# Altium schematic sheet carrier_card_s2.SchDoc: Power / Power-On/Off Sequencing
size A4; DrawnBy: Thomas Christensen; Revision: 2; SheetNumber: 2; SheetTotal: 3
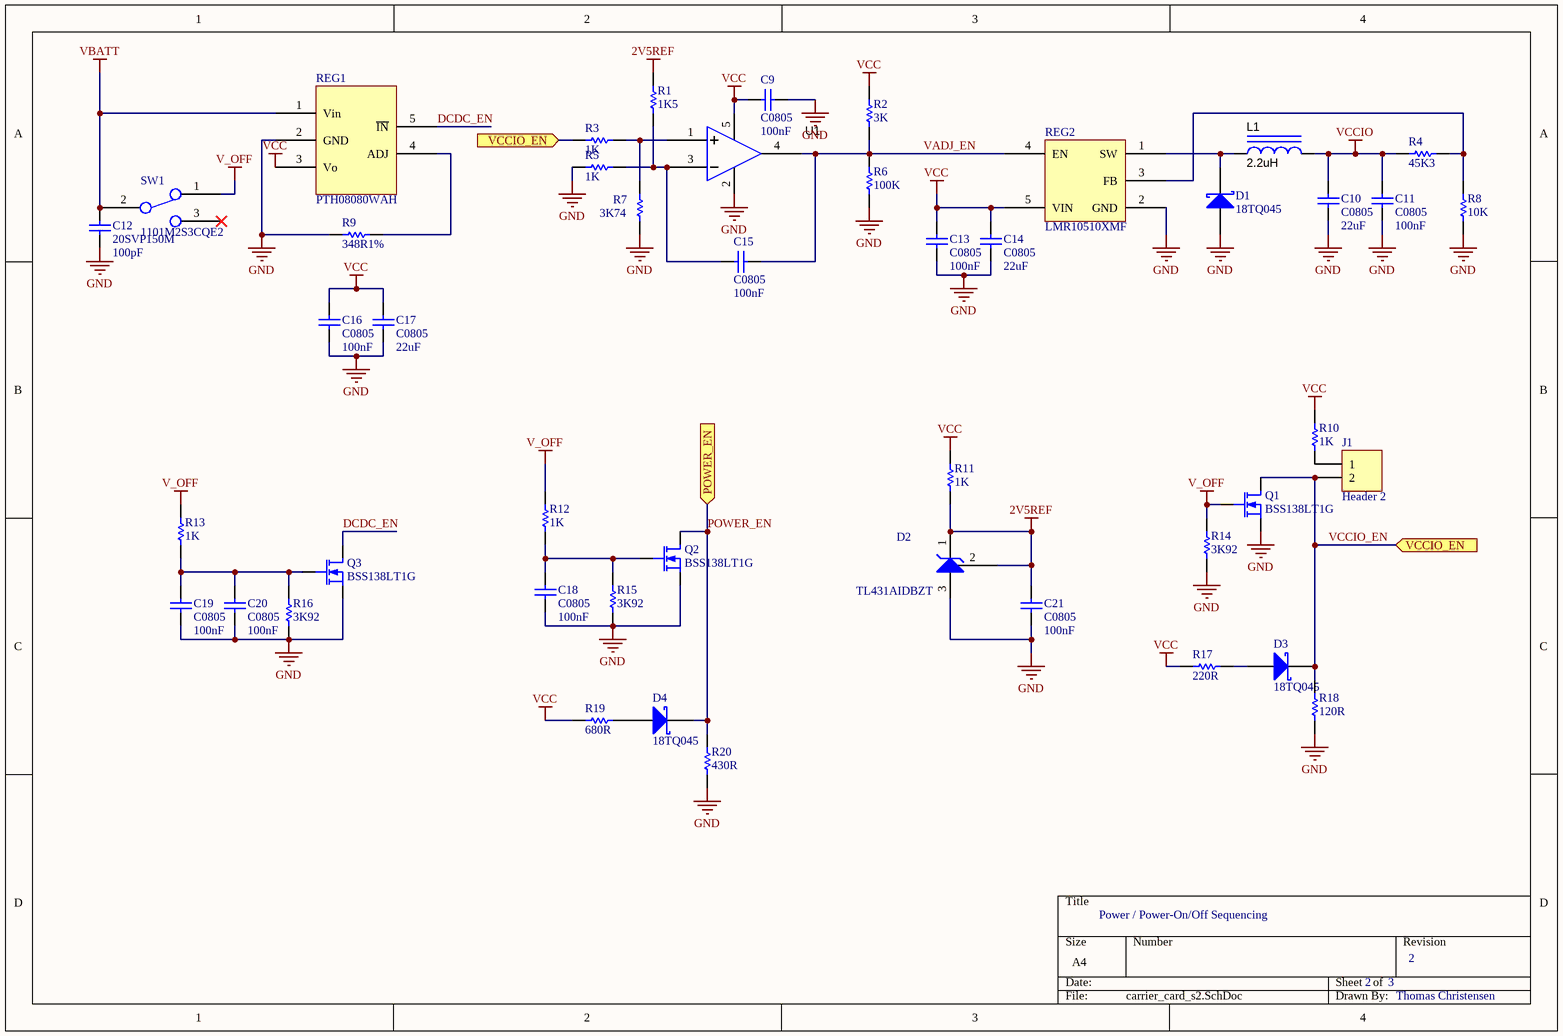
[diagram p0: carrier_card_s2.SchDoc]

## Parts
C9  C0805  value 100nF  [0805]
C10  C0805  value 22uF  [0805]
C11  C0805  value 100nF  [0805]
C12  20SVP150M  value 100pF  [20SVP150M_FP]
C13  C0805  value 100nF  [0805]
C14  C0805  value 22uF  [0805]
C15  C0805  value 100nF  [0805]
C16  C0805  value 100nF  [0805]
C17  C0805  value 22uF  [0805]
C18  C0805  value 100nF  [0805]
C19  C0805  value 100nF  [0805]
C20  C0805  value 100nF  [0805]
C21  C0805  value 100nF  [0805]
D1  18TQ045  [POWERDI-123]
D2  TL431AIDBZT  [SOT-23_N]
D3  18TQ045  [POWERDI-123]
D4  18TQ045  [POWERDI-123]
J1  Header 2  [HDR1X2]
L1  2.2uH  [SRN5020-2R2Y_FP]
Q1  BSS138LT1G  [SOT-23B]
Q2  BSS138LT1G  [SOT-23B]
Q3  BSS138LT1G  [SOT-23B]
R1  1K5  [ERA-0603]
R2  3K  [ERA-0603]
R3  1K  [ERA-0603]
R4  45K3  [ERA-0603]
R5  1K  [ERA-0603]
R6  100K  [ERA-0603]
R7  3K74  [ERA-0603]
R8  10K  [ERA-0603]
R9  348R1%  [ERA-0805]
R10  1K  [ERA-0603]
R11  1K  [ERA-0603]
R12  1K  [ERA-0603]
R13  1K  [ERA-0603]
R14  3K92  [ERA-0603]
R15  3K92  [ERA-0603]
R16  3K92  [ERA-0603]
R17  220R  [ERA-0603]
R18  120R  [ERA-0603]
R19  680R  [ERA-0603]
R20  430R  [ERA-0603]
REG1  PTH08080WAH  [PTH08080W_FP]
REG2  LMR10510XMF  [SOT23-5]
SW1  1101M2S3CQE2  [1101M2S3CQE2_FP]
U1  TLV2702  [SOT23-5]  (value not drawn)

## Ports
POWER_EN, VCCIO_EN

## Nets
2V5REF: C21.2 D2.1(K) D2.2 R1.2 R11.1
GND: C9.2 C10.1 C11.1 C12.1 C13.1 C14.1 C16.1 C17.1 C18.1 C19.1 C20.1 C21.1 D1.1(A) D2.3(A) Q1.2(S) Q2.2(S) Q3.2(S) R5.1 R6.1 R7.1 R8.1 R9.1 R14.1 R15.1 R16.1 R18.1 R20.1 REG1.2(GND) REG2.2(GND) U1.2(GND)
V_OFF: Q1.1(G) R12.2 R13.2 R14.2 SW1.1
VBATT: C12.2 REG1.1(Vin) SW1.2
VCC: C9.1 C13.2 C14.2 C16.2 C17.2 R2.2 R10.2 R11.2 R17.1 R19.1 REG1.3(Vo) REG2.5(VIN) U1.5(Vcc)
VCCIO: C10.2 C11.2 L1.2 R4.1
DCDC_EN: Q3.3(D) REG1.5(~{IN})
POWER_EN: D4.2(K) Q2.3(D) R20.2 ; port POWER_EN
VADJ_EN: C15.2 R2.1 R6.2 REG2.4(EN) U1.4(OUT)
VCCIO_EN: D3.2(K) J1.2 Q1.3(D) R3.1 R18.2 ; port VCCIO_EN
NetC15_1: C15.1 R1.1 R5.2 U1.3(IN-)
NetC18_2: C18.2 Q2.1(G) R12.1 R15.2
NetC19_2: C19.2 C20.2 Q3.1(G) R13.1 R16.2
NetD1_2: D1.2(K) L1.1 REG2.1(SW)
NetD3_1: D3.1(A) R17.2
NetD4_1: D4.1(A) R19.2
NetJ1_1: J1.1 R10.1
NetR3_2: R3.2 R7.2 U1.1(IN+)
NetR4_2: R4.2 R8.2 REG2.3(FB)
NetR9_2: R9.2 REG1.4(ADJ)

Not connected (* = marked no-connect by the designer): SW1 3*

## Library data of the parts
C9-C11 C13-C21 = C0805: Ceramic Chip Capacitor - Standard; Note: Footprint corresponds to dimensions for bulk cassette packaging. This case size has tightened tolerances.; Published: 17-Jul-2002; LatestRevisionDate: 19-Mar-2004; LatestRevisionNote: Silkscreen size reduced.; DatasheetDocument: Mar-2001; PackageDocument: Mar-2001; PackageReference: 0805; Publisher: Altium Limited; Code_JEITA: 0805; Code_IPC: 2012[0805]; ComponentLink1Description: Manufacturer Link; ComponentLink1URL: http://www.kemet.com/; ComponentLink2Description: Datasheet; ComponentLink2URL: http://www.kemet.com/kemet/web/homepage/kechome.nsf/vapubfilesname/F3102TA.pdf/$file/F3102TA.pdf
C12 = 20SVP150M: Capacitor (Semiconductor SIM Model); Published: 8-Jun-2000; LatestRevisionDate: 29-May-2009; LatestRevisionNote: IPC-7351 Footprint Added.; PackageReference: C1206; Publisher: Altium Limited; PackageDescription: Chip Capacitor
D1 D3 D4 = 18TQ045: Schottky Rectifier; Note: Terminal 2 is the TAB and is electrically connected to the cathode; Published: 8-Jun-2000; LatestRevisionDate: 17-Jul-2002; LatestRevisionNote: Re-released for DXP Platform.; DatasheetVersion: Dec-1997; PackageVersion: Feb-1998; PackageReference: TO-220AC; Publisher: Altium Limited; PackageDescription: TO, Thru-Hole, Vertical, Heatsink Mounted; 3 In-Line Leads (1 Absent); Pitch 2.54 mm; ComponentLink1Description: Manufacturer Link; ComponentLink1URL: http://www.irf.com/; ComponentLink2Description: Datasheet; ComponentLink2URL: http://www.irf.com/product-info/datasheets/data/18tq.pdf
D2 = TL431AIDBZT: Variable voltage  reference; Note: Pin 2 is not connected and not drawn.; Published: 21-Mar-2003; LatestRevisionDate: 29-May-2009; LatestRevisionNote: IPC-7351 Footprint Added.; DatasheetVersion: Oct-1999; PackageVersion: Sep-2001; PackageReference: SOT-23; Publisher: Altium Limited; PackageDescription: 3-Pin SOT-23 Package 0.95 mm Pitch, 2.5 mm Lead Span; ComponentLink1Description: Manufacturer Link; ComponentLink1URL: http://www.infineon.com/; ComponentLink2Description: Datasheet; ComponentLink2URL: http://www.infineon.com/upload/Document/cmc_upload/documents/012/5331/bas16series.pdf
J1 = Header 2: Header, 2-Pin; LatestRevisionDate: 17-Jul-2002; LatestRevisionNote: Re-released for DXP Platform.; Publisher: Altium Limited
L1 = SRN5020-2R2Y: Manufacturer 1: Cooper Bussmann; Manufacturer Part Number 1: DR73-100-R; Ratings: 2.1 A; Tolerance: ±20%; Material: ferrite shielded; SCDType: spec; Package / Case: 5.0x5.0x4.5mm; Supplier 1: Digi-Key; Supplier Part Number 1: 513-1129-1-ND; ComponentLink1URL: http://www.cooperindustries.com/content/dam/public/bussmann/Electronics/Resources/Data%20Sheets/Bus_Elx_DS_4315_DR_Series.pdf; ComponentLink1Description: http://www.cooperindustries.com/content/dam/public/bussmann/Electronics/Resources/Data%20Sheets/Bus_Elx_DS_4315_DR_Series.pdf; Value: 2.2uH
Q1-Q3 = BSS138LT1G: N-Channel MOSFET; Published: 8-Jun-2000; LatestRevisionDate: 17-Jul-2002; LatestRevisionNote: Re-released for DXP Platform.; PackageVersion: 1995/1996; PackageReference: E3; Publisher: Altium Limited; PackageDescription: TO, Flat Index; 3 In-Line, Axial Leads; Body Dia. 4.6mm; Lead Dia. 0.5 mm (max)
R1-R8 R10-R20 = ERA3Y: Rectangular Thick Film Chip Resistor, 10 Ohm to 330k Ohm Range, 0.1% and 0.5% Tolerance, 0603 Size, 0.063 W; Note: If flow soldering, adjust pad width of PCB Footprint to 0.7 - 0.8 times the width of the resistor.; Published: 17-Dec-2003; LatestRevisionDate: 19-Mar-2004; LatestRevisionNote: Silkscreen size reduced.; PackageDocument: Mar-2003; PackageReference: ERA-0603; Publisher: Altium Limited; Code_IPC: 1608 [0603]; ComponentLink1Description: Manufacturer Link; ComponentLink1URL: http://www.panasonic.com/industrial/components/resistive_products.htm; ComponentLink2Description: Datasheet; ComponentLink2URL: http://www.panasonic.com/industrial/components/pdf/AOA0000CE8.pdf
R9 = ERA6Y: Rectangular Thick Film Chip Resistor, 10 Ohm to 1M Ohm Range, 0.1% and 0.5% Tolerance, 0805 Size, 0.1 W; Note: If flow soldering, adjust pad width of PCB Footprint to 0.7 - 0.8 times the width of the resistor.; Published: 17-Dec-2003; LatestRevisionDate: 19-Mar-2004; LatestRevisionNote: Silkscreen size reduced.; PackageDocument: Mar-2003; PackageReference: ERA-0805; Publisher: Altium Limited; Code_IPC: 2012 [0805]; ComponentLink1Description: Manufacturer Link; ComponentLink1URL: http://www.panasonic.com/industrial/components/resistive_products.htm; ComponentLink2Description: Datasheet; ComponentLink2URL: http://www.panasonic.com/industrial/components/pdf/AOA0000CE8.pdf
U1 = LMV331QDBVRQ1: IC SMD AMP+COMPAR Combo SOIC-8; Manufacturer 1: Texas Instruments; Manufacturer Part Number 1: TLV2702ID; Voltage - Supply: 2.7 V ~ 16 V, ±1.35 V ~ 8 V; SCDType: undef; Package / Case: 8-SOIC (0.154", 3.90mm Width); Supplier 1: Digi-Key; Supplier Part Number 1: 296-12503-5-ND